# EAGLE design trotsky (EAGLE 5.11)
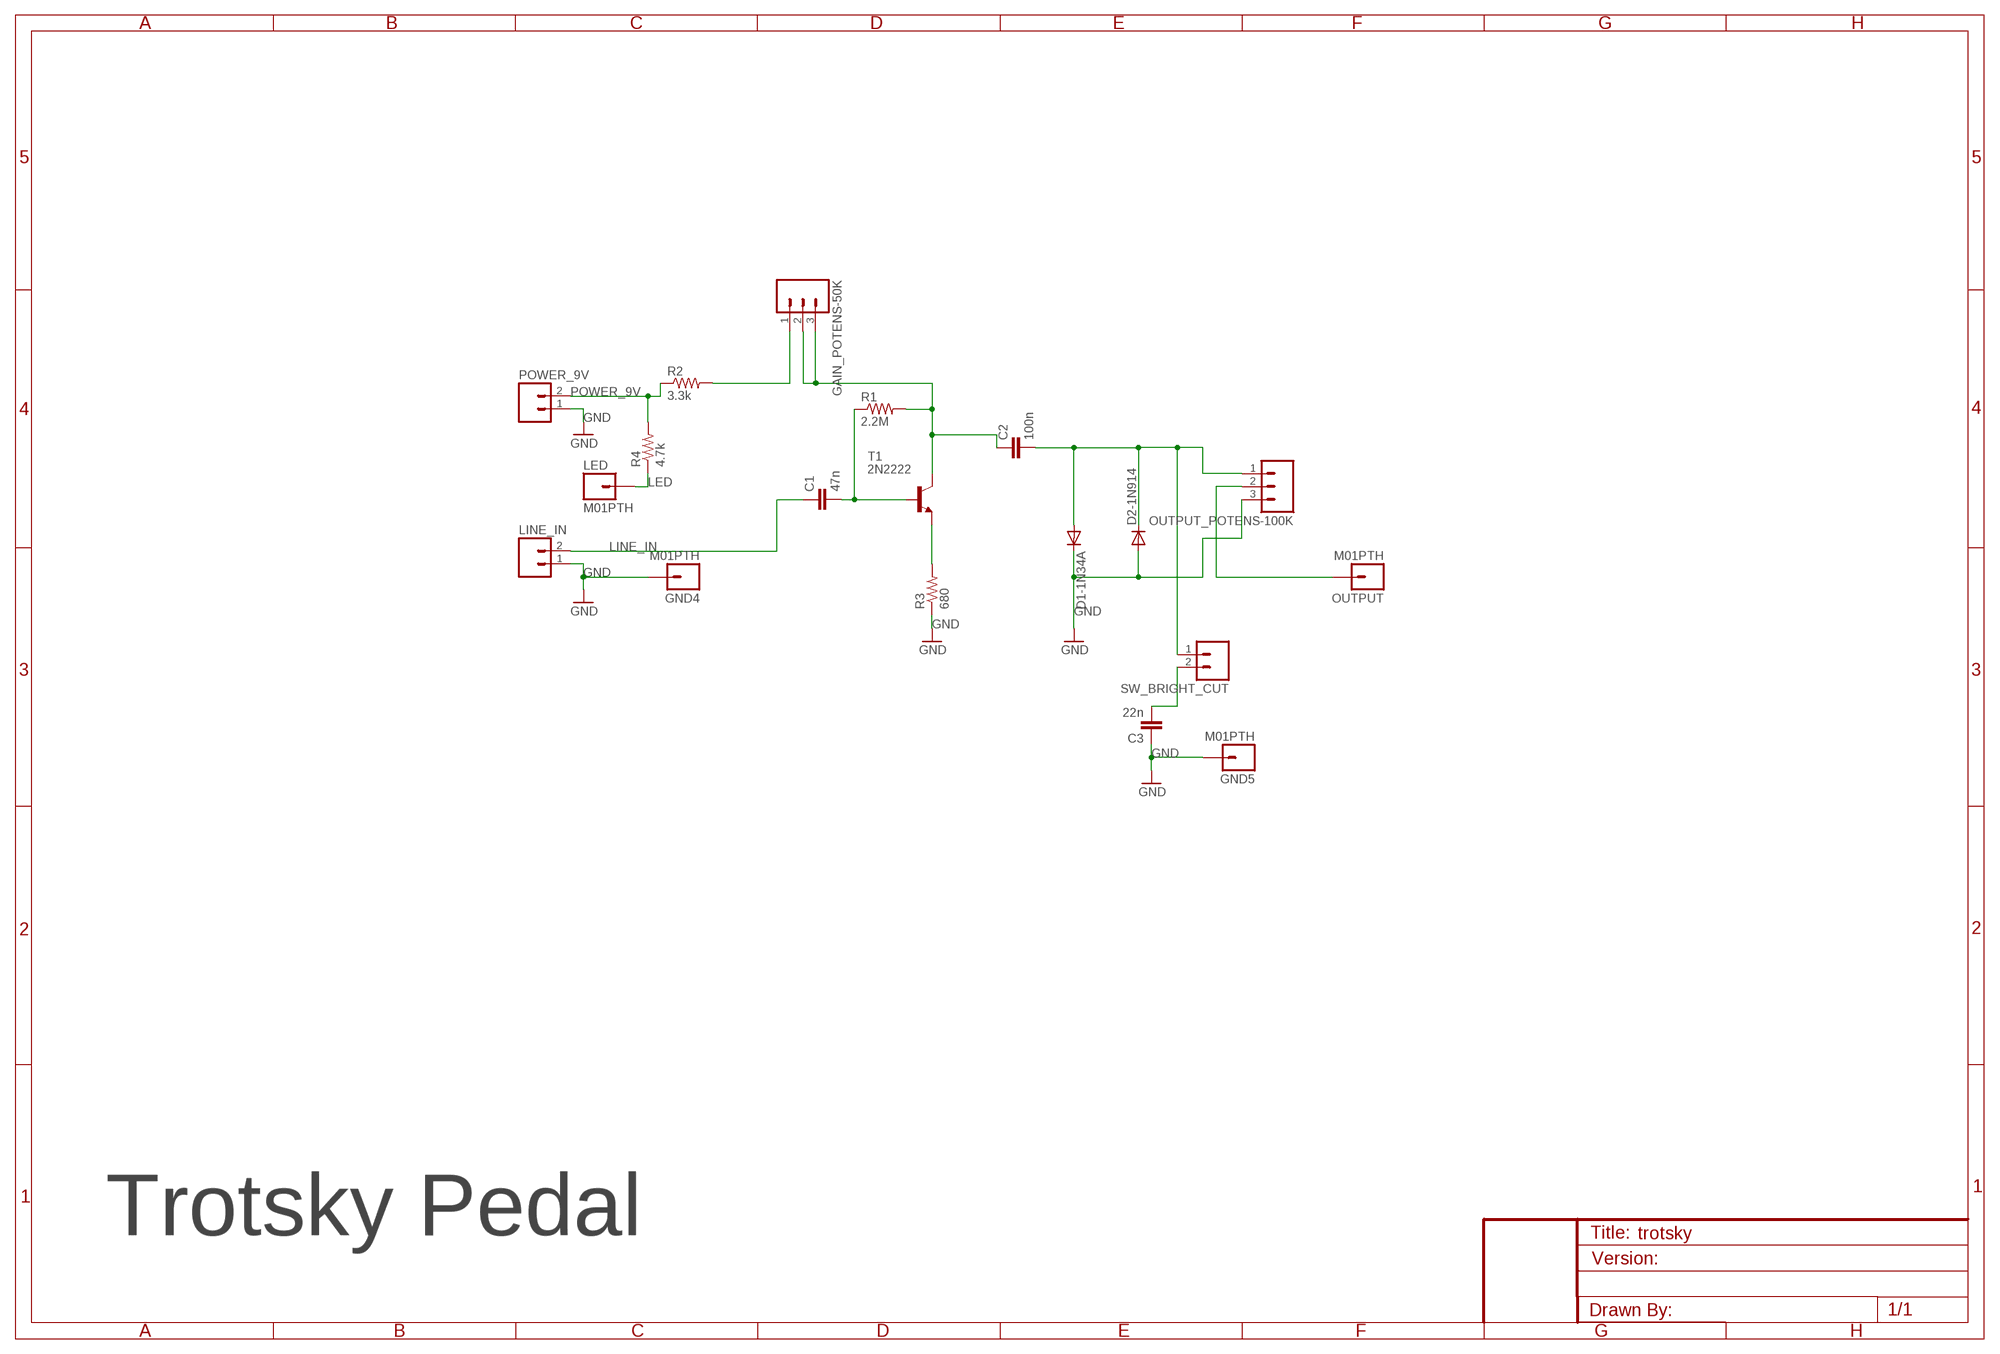
[diagram p0: schematic, sheet 1]

## Parts
C1  47n  CAPPTH2  [CAP-PTH-SMALL2]
C2  100n  CAPPTH2  [CAP-PTH-SMALL2]
C3  22n  CAPPTH2  [CAP-PTH-SMALL2]
D1-1N34A  DIODEPTH  [DIODE-1N4001]
D2-1N914  DIODEPTH  [DIODE-1N4001]
GAIN_POTENS-50K  M03PTH  [1X03]
GND4  M01PTH  [1X01]
GND5  M01PTH  [1X01]
LED  M01PTH  [1X01]
LINE_IN  M02PTH  [1X02]
OUTPUT  M01PTH  [1X01]
OUTPUT_POTENS-100K  M03PTH  [1X03]
POWER_9V  M02PTH  [1X02]
R1  2.2M  RESISTORPTH1  [AXIAL-0.3]
R2  3.3k  RESISTORPTH1  [AXIAL-0.3]
R3  680  RESISTORPTH1  [AXIAL-0.3]
R4  4.7k  RESISTORPTH1  [AXIAL-0.3]
SW_BRIGHT_CUT  M02PTH  [1X02]
T1  2N2222  [TO18]

## Nets
B: C1.2 R1.P$1 T1.2(B)
C: C2.1 GAIN_POTENS-50K.2 GAIN_POTENS-50K.3 R1.P$2 T1.3(C)
E: R3.P$2 T1.1(E)
GND [net_GND]: C3.1 D1-1N34A.C D2-1N914.A GND4.1 GND5.1 LINE_IN.1 OUTPUT_POTENS-100K.3 POWER_9V.1 R3.P$1
LED: LED.1 R4.P$1
LINE_IN: C1.1 LINE_IN.2
N$3: C3.2 SW_BRIGHT_CUT.2
N$4: C2.2 D1-1N34A.A D2-1N914.C OUTPUT_POTENS-100K.1 SW_BRIGHT_CUT.1
N$5: OUTPUT.1 OUTPUT_POTENS-100K.2
N$6: GAIN_POTENS-50K.1 R2.P$2
POWER_9V: POWER_9V.2 R2.P$1 R4.P$2

## Notes on the sheet
- Trotsky Pedal

## Library data of the parts
C1-C3 = SparkFun:CAP: Capacitor Standard 0603 ceramic capacitor, and 0.1" leaded capacitor.
D1-1N34A D2-1N914 = SparkFun:DIODE: Diode These are standard reverse protection diodes and small signal diodes. SMA package can handle up to about 1A. SOD-323 can handle about 200mA. What the SOD-323 package when ordering, there are some mfgs out there that are 5-pin packages.
GAIN_POTENS-50K OUTPUT_POTENS-100K = SparkFun:M03: Header 3 Standard 3-pin 0.1" header. Use with straight break away headers (SKU : PRT-00116), right angle break away headers (PRT-00553), swiss pins (PRT-00743), machine pins (PRT-00117), and female headers (PRT-00115). Molex polarized connector foot print use with SKU : PRT-08232 with associated crimp pins and housings.
GND4 GND5 LED OUTPUT = SparkFun:M01: Header 1 Standard 1-pin 0.1" header. Use with straight break away headers (SKU : PRT-00116), right angle break away headers (PRT-00553), swiss pins (PRT-00743), machine pins (PRT-00117), and female headers (PRT-00115).
LINE_IN POWER_9V SW_BRIGHT_CUT = SparkFun:M02: Header 2 Standard 2-pin 0.1" header. Use with straight break away headers (SKU : PRT-00116), right angle break away headers (PRT-00553), swiss pins (PRT-00743), machine pins (PRT-00117), and female headers (PRT-00115). Molex polarized connector foot print use with SKU : PRT-08233 with associated crimp pins and housings.
R1-R4 = SparkFun:RESISTOR: Resistor Basic schematic elements and footprints for 0603, 1206, and PTH 1/10th watt (small) resistors.
T1 = transistor:2N2222: NPN TRANSISTOR

## Net classes
0 default: width 0.381 mm, drill 0.381 mm, clearance 0.381 mm
1 net_GND: width 0.508 mm, drill 0.508 mm

## Board
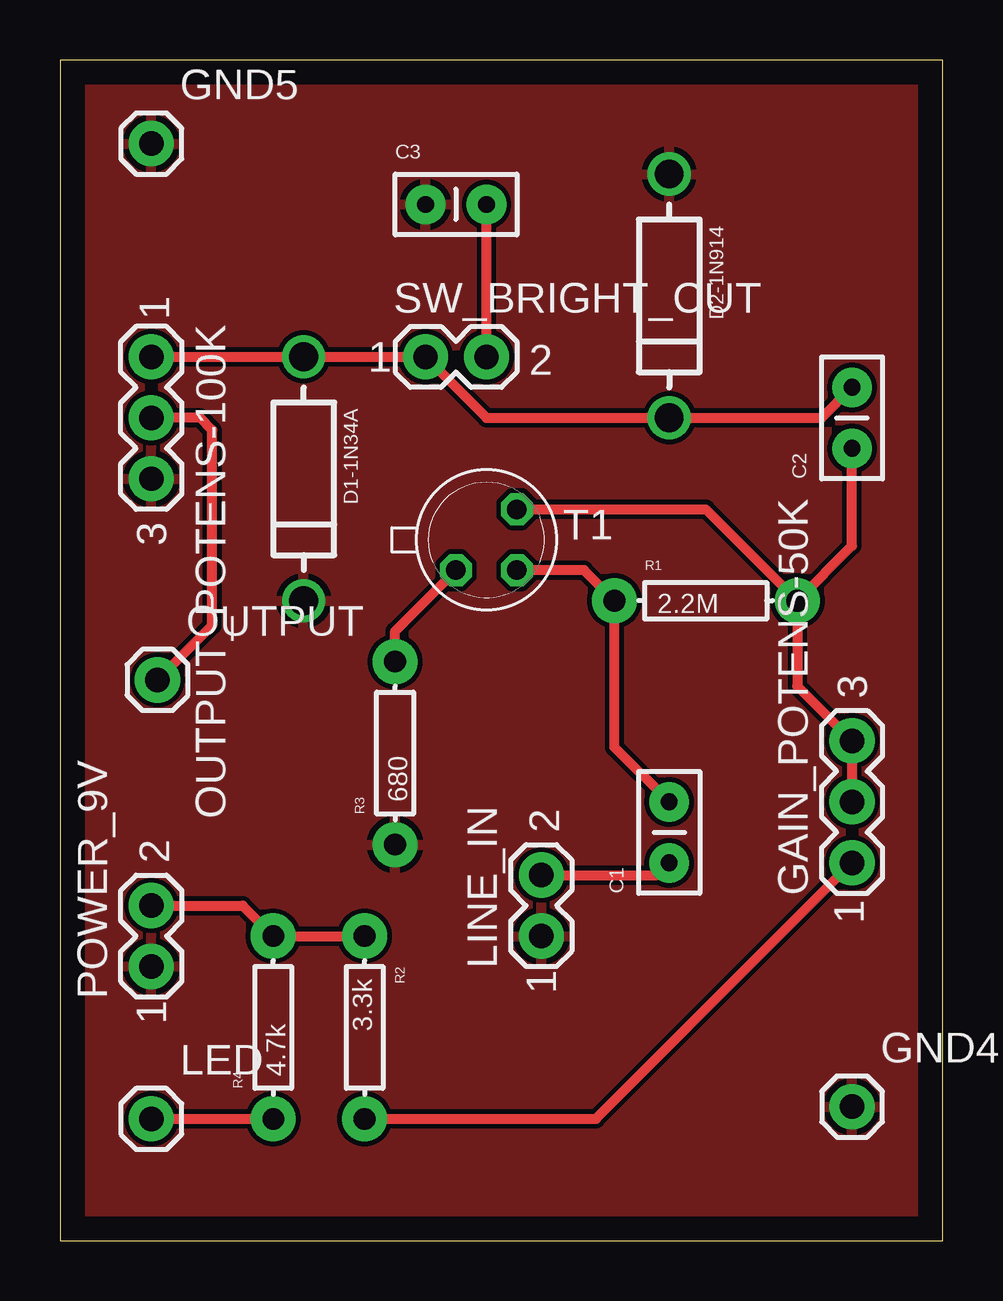
[diagram p1: board, top side]

Size 36.81 x 49.2 mm. Coordinates in mm from the lower left corner, seen from the top.
Outline: 0,0 36.81,0 36.81,49.2 0,49.2 0,0
Copper layers (1*16): Top 0.035mm / dielectric 1.5mm / Bottom 0.035mm
Design rules "default": minimum track width 10mil, minimum drill 24mil, track to track 8mil, track to pad 8mil, pad to pad 8mil, via to via 8mil, smd to smd 8mil, copper to edge 40mil, drill to drill 8mil, minimum pad ring 10mil, minimum via ring 8mil, stop-mask expansion 4mil, vias tented up to drill 0mil, thermal gap 10mil

### Footprints (pad centres in the part's own frame; a part is rotated, then mirrored left to right if it is on the bottom)
CAP-PTH-SMALL2 = drill 0.7 pad 1.651 round: 1 0,0; 2 2.54,0
DIODE-1N4001 = drill 1.2 round: A -5.08,0; C 5.08,0
1X03 = drill 1.016 pad 1.88 round: 1 0,0; 2 2.54,0; 3 5.08,0
1X01 = drill 1.016 pad 1.88 round: 1 0,0
1X02 = drill 1.016 pad 1.88 round: 1 0,0; 2 2.54,0
AXIAL-0.3 = drill 0.9 pad 1.88 round: P$1 -3.81,0; P$2 3.81,0
TO18 = drill 0.813 octagon: 1 -1.27,-1.27; 2 1.27,-1.27; 3 1.27,1.27

### Placement (x,y rotation side)
C1  25.4,15.75 90 top
C2  33.02,33.02 90 top
C3  15.24,43.18 0 top
D1-1N34A  10.16,31.75 270 top
D2-1N914  25.4,39.37 270 top
GAIN_POTENS-50K  33.02,15.75 90 top
GND4  33.02,5.59 0 top
GND5  3.81,45.72 0 top
LED  3.81,5.08 0 top
LINE_IN  20.07,12.7 90 top
OUTPUT  4.06,23.37 0 top
OUTPUT_POTENS-100K  3.81,36.83 270 top
POWER_9V  3.81,11.43 90 top
R1  26.92,26.67 0 top
R2  12.7,8.89 270 top
R3  13.97,20.32 90 top
R4  8.89,8.89 90 top
SW_BRIGHT_CUT  15.24,36.83 0 top
T1  17.78,29.21 0 top

### Tracks (layer width: path | path; a pad name or v marks a point on that pad's centre or on a via)
B
  Top 0.406: T1.2 21.84,27.94 R1.P$1 23.11,20.57 C1.2
C
  Top 0.406: T1.3 26.92,30.48 R1.P$2 | C2.1 33.02,28.96 R1.P$2 | R1.P$2 30.73,23.11 GAIN_POTENS-50K.3 GAIN_POTENS-50K.2
E
  Top 0.406: R3.P$2 13.97,25.4 T1.1
GND
  pour Top: 0,49.02 0,0 36.83,0 36.83,49.28 0,49.28
LED
  Top 0.406: LED.1 R4.P$1
LINE_IN
  Top 0.406: LINE_IN.2 24.89,15.24 C1.1
N$3
  Top 0.406: SW_BRIGHT_CUT.2 C3.2
N$4
  Top 0.406: C2.2 31.75,34.29 D2-1N914.C 17.78,34.29 SW_BRIGHT_CUT.1 D1-1N34A.A OUTPUT_POTENS-100K.1
N$5
  Top 0.406: OUTPUT_POTENS-100K.2 5.84,34.29 6.35,33.78 6.35,25.65 OUTPUT.1
N$6
  Top 0.406: R2.P$2 22.35,5.08 GAIN_POTENS-50K.1
POWER_9V
  Top 0.406: POWER_9V.2 7.62,13.97 R4.P$2 R2.P$1